# Altium schematic sheet ascenseur-motors.SchDoc
size A4
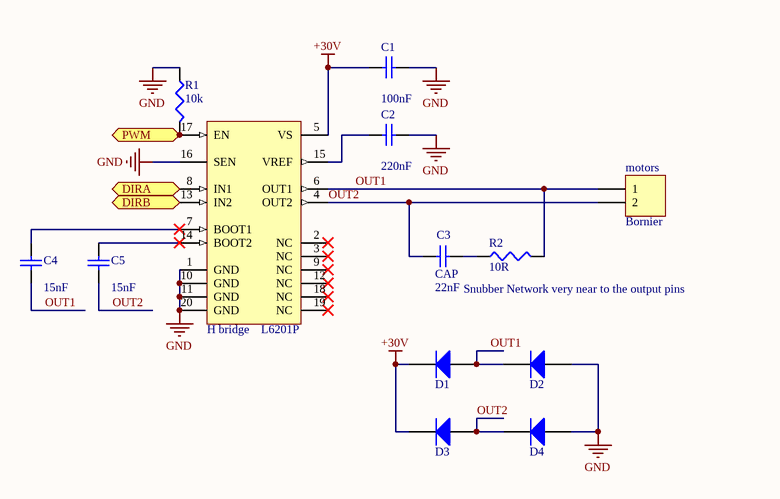
[diagram p0: ascenseur-motors.SchDoc]

## Parts
C1  value 100nF  [C0805C]  (hidden comment: CAP)
C2  value 220nF  [C0805C]  (hidden comment: CAP)
C3  CAP  value 22nF  [C0805C]
C4  value 15nF  [C0805C]  (hidden comment: CAP)
C5  value 15nF  [C0805C]  (hidden comment: CAP)
D1  Diode  [DSO-C2/X3.3]  (value not drawn)
D2  Diode  [DSO-C2/X3.3]  (value not drawn)
D3  Diode  [DSO-C2/X3.3]  (value not drawn)
D4  Diode  [DSO-C2/X3.3]  (value not drawn)
H_bridge  L6201P  [PowerSO20_M]
motors  Bornier  [Bornier male coude 2 voies]
R1  value 10k  [C0805R]  (hidden comment: RES)
R2  value 10R  [C0805R]  (hidden comment: RES)

## Ports
DIRA (in), DIRB (in), PWM (in)

## Nets
+30V: C1.2 D1.K D3.K H_bridge.5(VS)
GND: C1.1 C2.1 D2.A D4.A H_bridge.1(GND) H_bridge.10(GND) H_bridge.11(GND) H_bridge.16(SEN) H_bridge.20(GND) R1.1
DIRA: H_bridge.8(IN1) ; port DIRA
DIRB: H_bridge.13(IN2) ; port DIRB
OUT1: C4.2 D1.A D2.K H_bridge.6(OUT1) motors.1 R2.2
OUT2: C3.2 C5.2 D3.A D4.K H_bridge.4(OUT2) motors.2
PWM: H_bridge.17(EN) R1.2 ; port PWM
NetC2_2: C2.2 H_bridge.15(VREF)
NetC3_1: C3.1 R2.1
NetC4_1: C4.1 H_bridge.7(BOOT1)
NetC5_1: C5.1 H_bridge.14(BOOT2)

Not connected (* = marked no-connect by the designer): H_bridge 2(NC)* 3(NC)* 9(NC)* 12(NC)* 18(NC)* 19(NC)*

## Notes on the sheet
- Snubber Network very near to the output pins

## Library data of the parts
C1-C5 = CAP: Capacitor; Published: 8-Jun-2000; LatestRevisionDate: 29-May-2009; LatestRevisionNote: IPC-7351 Footprint Added.; PackageReference: C1206; Publisher: Altium Limited; PackageDescription: Chip Capacitor
D1-D4 = Diode: Default Diode; Published: 8-Jun-2000; LatestRevisionDate: 17-Jul-2002; LatestRevisionNote: Re-released for DXP Platform.; PackageVersion: Sep-1996; PackageReference: SMC; Publisher: Altium Limited; PackageDescription: DO-214-AB/SMC; 2 C-Bend Leads; Body 7.9 x 5.9 mm, inc. leads (LxW); Code_JEDEC: DO-214-AB
H_bridge = L6201P: DMOS Full Bridge Driver; Published: 8-Jun-2000; LatestRevisionDate: 13-Apr-2006; LatestRevisionNote: IPC-7351 Footprint Added.; DatasheetVersion: Sep-1996; PackageVersion: May-1998; PackageReference: PowerSO20; Publisher: Altium Limited; PackageDescription: 20-Pin Small Outline Package 1.27 mm Pitch; Code_JEDEC: MO-166; ComponentLink1Description: Manufacturer Link; ComponentLink1URL: http://www.st.com/
motors = Header 2: Header, 2-Pin; LatestRevisionDate: 17-Jul-2002; LatestRevisionNote: Re-released for DXP Platform.; Publisher: Altium Limited
R1 R2 = RES: Resistor; Published: 8-Jun-2000; LatestRevisionDate: 29-May-2009; LatestRevisionNote: IPC-7351 Footprint Added.; PackageReference: J1-0603; Publisher: Altium Limited; PackageDescription: Chip Resistor